# EAGLE design 230V2LED (EAGLE 6.3)
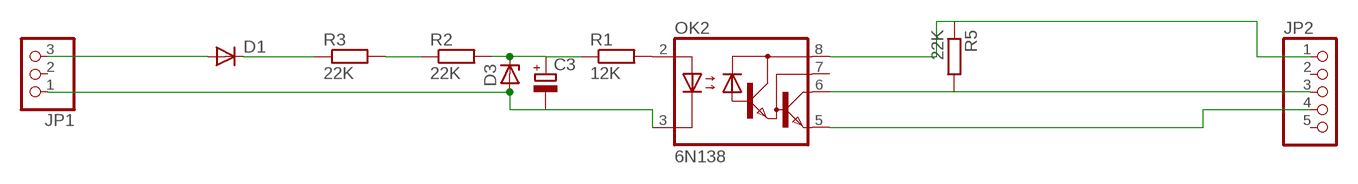
[diagram p0: schematic, sheet 1]

## Parts
C3  CPOL-EUE2,5-6E  [E2,5-6E]
D1  DIODE-D-2.5  [D-2.5]
D3  ZENER-DIODEZD-2.5  [ZDIO-2.5]
JP1  PINHD-1X3  [1X03]
JP2  PINHD-1X5  [1X05]
OK2  6N138  [DIL08]
R1  12K  R-EU_0207/2V  [0207/2V]
R2  22K  R-EU_0207/2V  [0207/2V]
R3  22K  R-EU_0207/2V  [0207/2V]
R5  22K  R-EU_0207/2V  [0207/2V]

## Nets
N$1: JP2.1 OK2.8(VCC) R5.1
N$2: JP2.4 OK2.5(GND)
N$3: JP2.3 OK2.6(VO) R5.2
N$4: D1.C R3.1
N$5: R2.1 R3.2
N$6: OK2.2(A) R1.2
N$8: D1.A JP1.3
N$9: C3.- D3.A JP1.1 OK2.3(C)
N$10: C3.+ D3.C R1.1 R2.2
Unconnected: JP1.2 JP2.2 JP2.5 OK2.7(VB)

## Library data of the parts
C3 = rcl:CPOL-EU: POLARIZED CAPACITOR, European symbol
D1 = diode:DIODE-: DIODE
D3 = diode:ZENER-DIODE: Z-Diode
JP1 = pinhead:PINHD-1X3: PIN HEADER
JP2 = pinhead:PINHD-1X5: PIN HEADER
OK2 = optocoupler:6N138: MOTOROLA OPTO COUPLER; MF: VISHAY/TELEFUNKEN; MPN: 6N138; OC_FARNELL: 9860150; OC_NEWARK: 35K5294
R1-R3 R5 = resistor:R-EU_: RESISTOR, European symbol

## Board
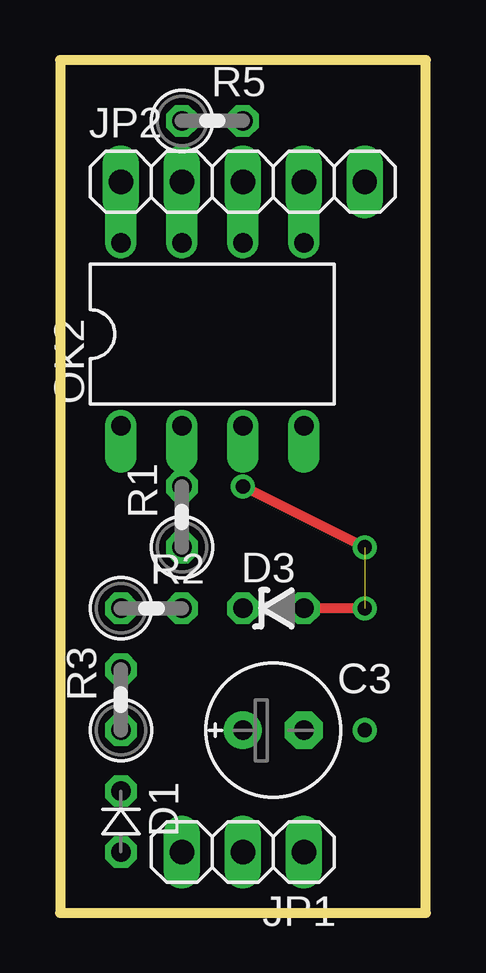
[diagram p1: board, top side]
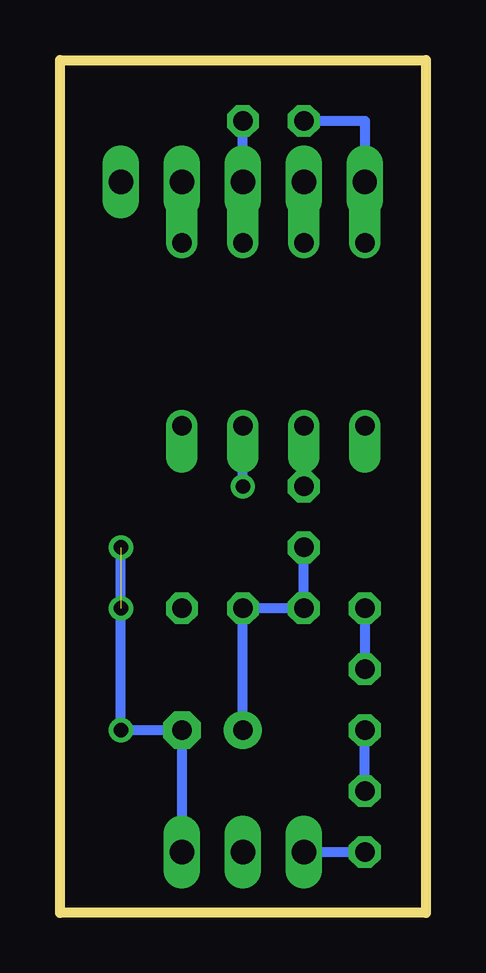
[diagram p2: board, bottom side, seen from below]

Size 15.24 x 35.56 mm. Coordinates in mm from the lower left corner, seen from the top.
Outline: 0,0 15.24,0 15.24,35.56 0,35.56 0,0
Copper layers (1*16): Top 0.035mm / dielectric 1.5mm / Bottom 0.035mm
Design rules "default": minimum track width 10mil, minimum drill 24mil, track to track 8mil, track to pad 8mil, pad to pad 8mil, via to via 8mil, smd to smd 8mil, copper to edge 40mil, drill to drill 8mil, minimum pad ring 10mil, minimum via ring 8mil, stop-mask expansion 4mil, vias tented up to drill 0mil, thermal gap 10mil

### Footprints (pad centres in the part's own frame; a part is rotated, then mirrored left to right if it is on the bottom)
E2,5-6E = drill 0.813 pad 1.575: + -1.27,0 | drill 0.813 pad 1.575 octagon: - 1.27,0
D-2.5 = drill 0.813 octagon: A 1.27,0; C -1.27,0
ZDIO-2.5 = drill 0.813 octagon: A 1.27,0; C -1.27,0
1X03 = drill 1.016 long: 1 -2.54,0; 2 0,0; 3 2.54,0
1X05 = drill 1.016 long: 1 -5.08,0; 2 -2.54,0; 3 0,0; 4 2.54,0; 5 5.08,0
DIL08 = drill 0.813 offset: 1 -3.81,-3.81; 2 -1.27,-3.81; 3 1.27,-3.81; 4 3.81,-3.81; 5 3.81,3.81; 6 1.27,3.81; 7 -1.27,3.81; 8 -3.81,3.81
0207/2V = drill 0.813 octagon: 1 -1.27,0; 2 1.27,0

### Placement (x,y rotation side)
C3  8.89,7.62 0 top
D1  2.54,3.81 270 top
D3  8.89,12.7 0 top
JP1  7.62,2.54 180 top
JP2  7.62,30.48 0 top
OK2  6.35,24.13 0 top
R1  5.08,16.51 90 top
R2  3.81,12.7 0 top
R3  2.54,8.89 90 top
R5  6.35,33.02 0 top

### Tracks (layer width: path | path; a pad name or v marks a point on that pad's centre or on a via)
N$1
  Bottom 0.406: OK2.8 JP2.1 2.54,33.02 R5.1
N$2
  Bottom 0.406: OK2.5 JP2.4
N$3
  Bottom 0.406: OK2.6 JP2.3 R5.2
N$4
  Bottom 0.406: D1.C R3.1
N$5
  Bottom 0.406: R2.1 R3.2
N$6
  Bottom 0.406: R1.2 OK2.2
N$8
  Bottom 0.406: JP1.3 D1.A
N$9  (via drill 0.6)  (1 unrouted)
  Top 0.406: v12.7,15.24 v7.62,17.78 | v12.7,12.7 D3.A
  Bottom 0.406: JP1.1 C3.- v12.7,7.62 v12.7,15.24 | v7.62,17.78 OK2.3
N$10
  Bottom 0.406: C3.+ D3.C R2.2 R1.1